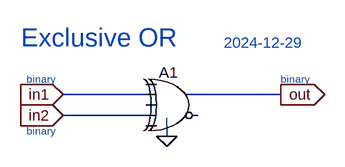
[diagram p0: schematic EXOR.asc]
EXOR.asc, the LTspice schematic file:
Version 4
SHEET 1 880 680
WIRE 160 128 32 128
WIRE 368 128 224 128
WIRE 160 160 32 160
WIRE 192 192 192 176
FLAG 192 192 0
FLAG 32 128 in1
IOPIN 32 128 In
FLAG 32 160 in2
IOPIN 32 160 In
FLAG 368 128 out
IOPIN 368 128 Out
SYMBOL Digital\\xor 208 80 R0
WINDOW 0 -28 14 Left 2
SYMATTR InstName A1
TEXT -24 104 Left 1 ;binary
TEXT -24 184 Left 1 ;binary
TEXT 368 104 Left 1 ;binary
TEXT -32 40 Left 4 ;Exclusive OR
TEXT 280 48 Left 2 ;2024-12-29

The netlist it stands for:
* EXOR.asc
A1 0 in1 0 in2 0 0 out 0 XOR
* binary
* binary
* binary
* Exclusive OR
* 2024-12-29
.backanno
.end